# EAGLE schematic C3D ReMix Expansion - Extruder Board (EAGLE 6.4)
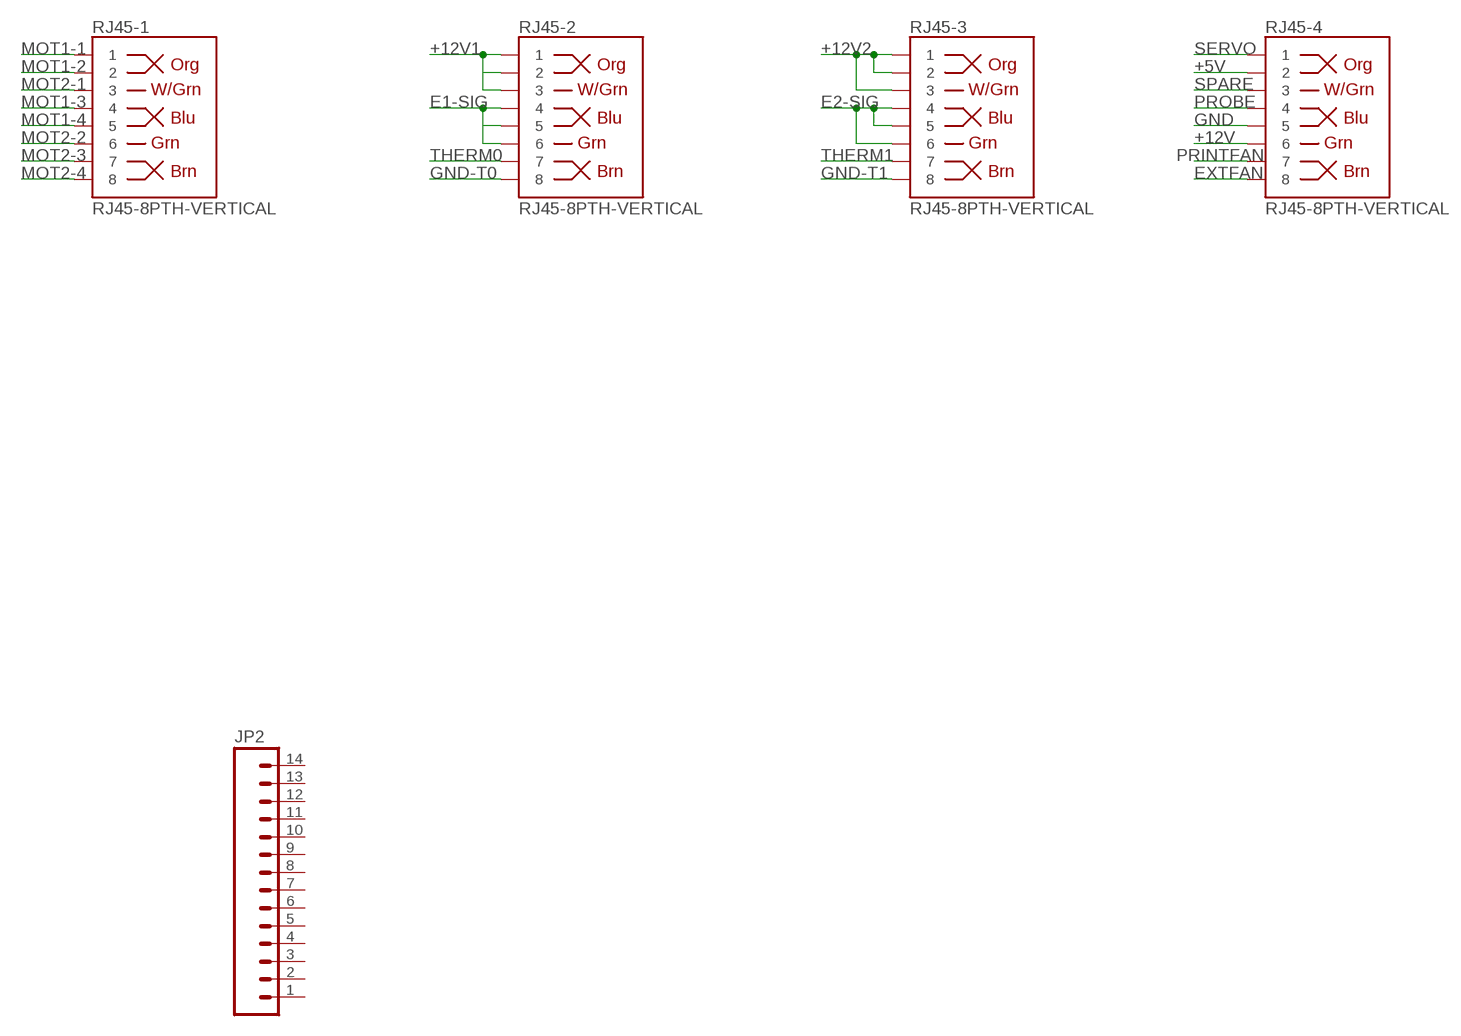
[diagram p0: schematic, sheet 1]

## Parts
JP2  M14  [1X14]
RJ45-1  RJ45-8PTH-VERTICAL  [RJ45-8]
RJ45-2  RJ45-8PTH-VERTICAL  [RJ45-8]
RJ45-3  RJ45-8PTH-VERTICAL  [RJ45-8]
RJ45-4  RJ45-8PTH-VERTICAL  [RJ45-8]

## Nets
+5V [power]: RJ45-4.2
+12V: RJ45-4.6
+12V1 [3.3-Amp Class]: RJ45-2.1 RJ45-2.2 RJ45-2.3
+12V2 [3.3-Amp Class]: RJ45-3.1 RJ45-3.2 RJ45-3.3
E1-SIG [3.3-Amp Class]: RJ45-2.4 RJ45-2.5 RJ45-2.6
E2-SIG [3.3-Amp Class]: RJ45-3.4 RJ45-3.5 RJ45-3.6
EXTFAN: RJ45-4.8
GND [power]: RJ45-4.5
GND-T0: RJ45-2.8
GND-T1: RJ45-3.8
MOT1-1 [power]: RJ45-1.1
MOT1-2 [power]: RJ45-1.2
MOT1-3 [power]: RJ45-1.4
MOT1-4 [power]: RJ45-1.5
MOT2-1 [power]: RJ45-1.3
MOT2-2 [power]: RJ45-1.6
MOT2-3 [power]: RJ45-1.7
MOT2-4 [power]: RJ45-1.8
PRINTFAN: RJ45-4.7
PROBE: RJ45-4.4
SERVO [power]: RJ45-4.1
SPARE: RJ45-4.3
THERM0: RJ45-2.7
THERM1: RJ45-3.7
Unconnected: JP2.1 JP2.2 JP2.3 JP2.4 JP2.5 JP2.6 JP2.7 JP2.8 JP2.9 JP2.10 JP2.11 JP2.12 JP2.13 JP2.14

## Library data of the parts
JP2 = SparkFun-Connectors:M14: Header 14 Standard 14-pin 0.1" header. Use with straight break away headers (SKU : PRT-00116), right angle break away headers (PRT-00553), swiss pins (PRT-00743), machine pins (PRT-00117), and female headers (PRT-00115).
RJ45-1-RJ45-4 = SparkFun-Connectors:RJ45-8: RJ45 Jack Simple RJ45, 8-pin connection - connector for common Cat5, Cat5e, and Cat6 Ethernet cables. Footprint not yet proven in production. Connector sku is PRT-00643; Breakout PCB sku is BOB-00716.

## Net classes
1 power: width 0.508 mm
5 3.3-Amp Class: width 1.524 mm